# EasyEDA schematic SCH_MR2-reactive-led-system-new-audio-system_2026-09-23.json
TITLE: Reactive LED System; REV: 1.0; Date: 2026-07-09; Sheet: 1/1; Drawn By: Kilian Mckinstry; Company: N/A
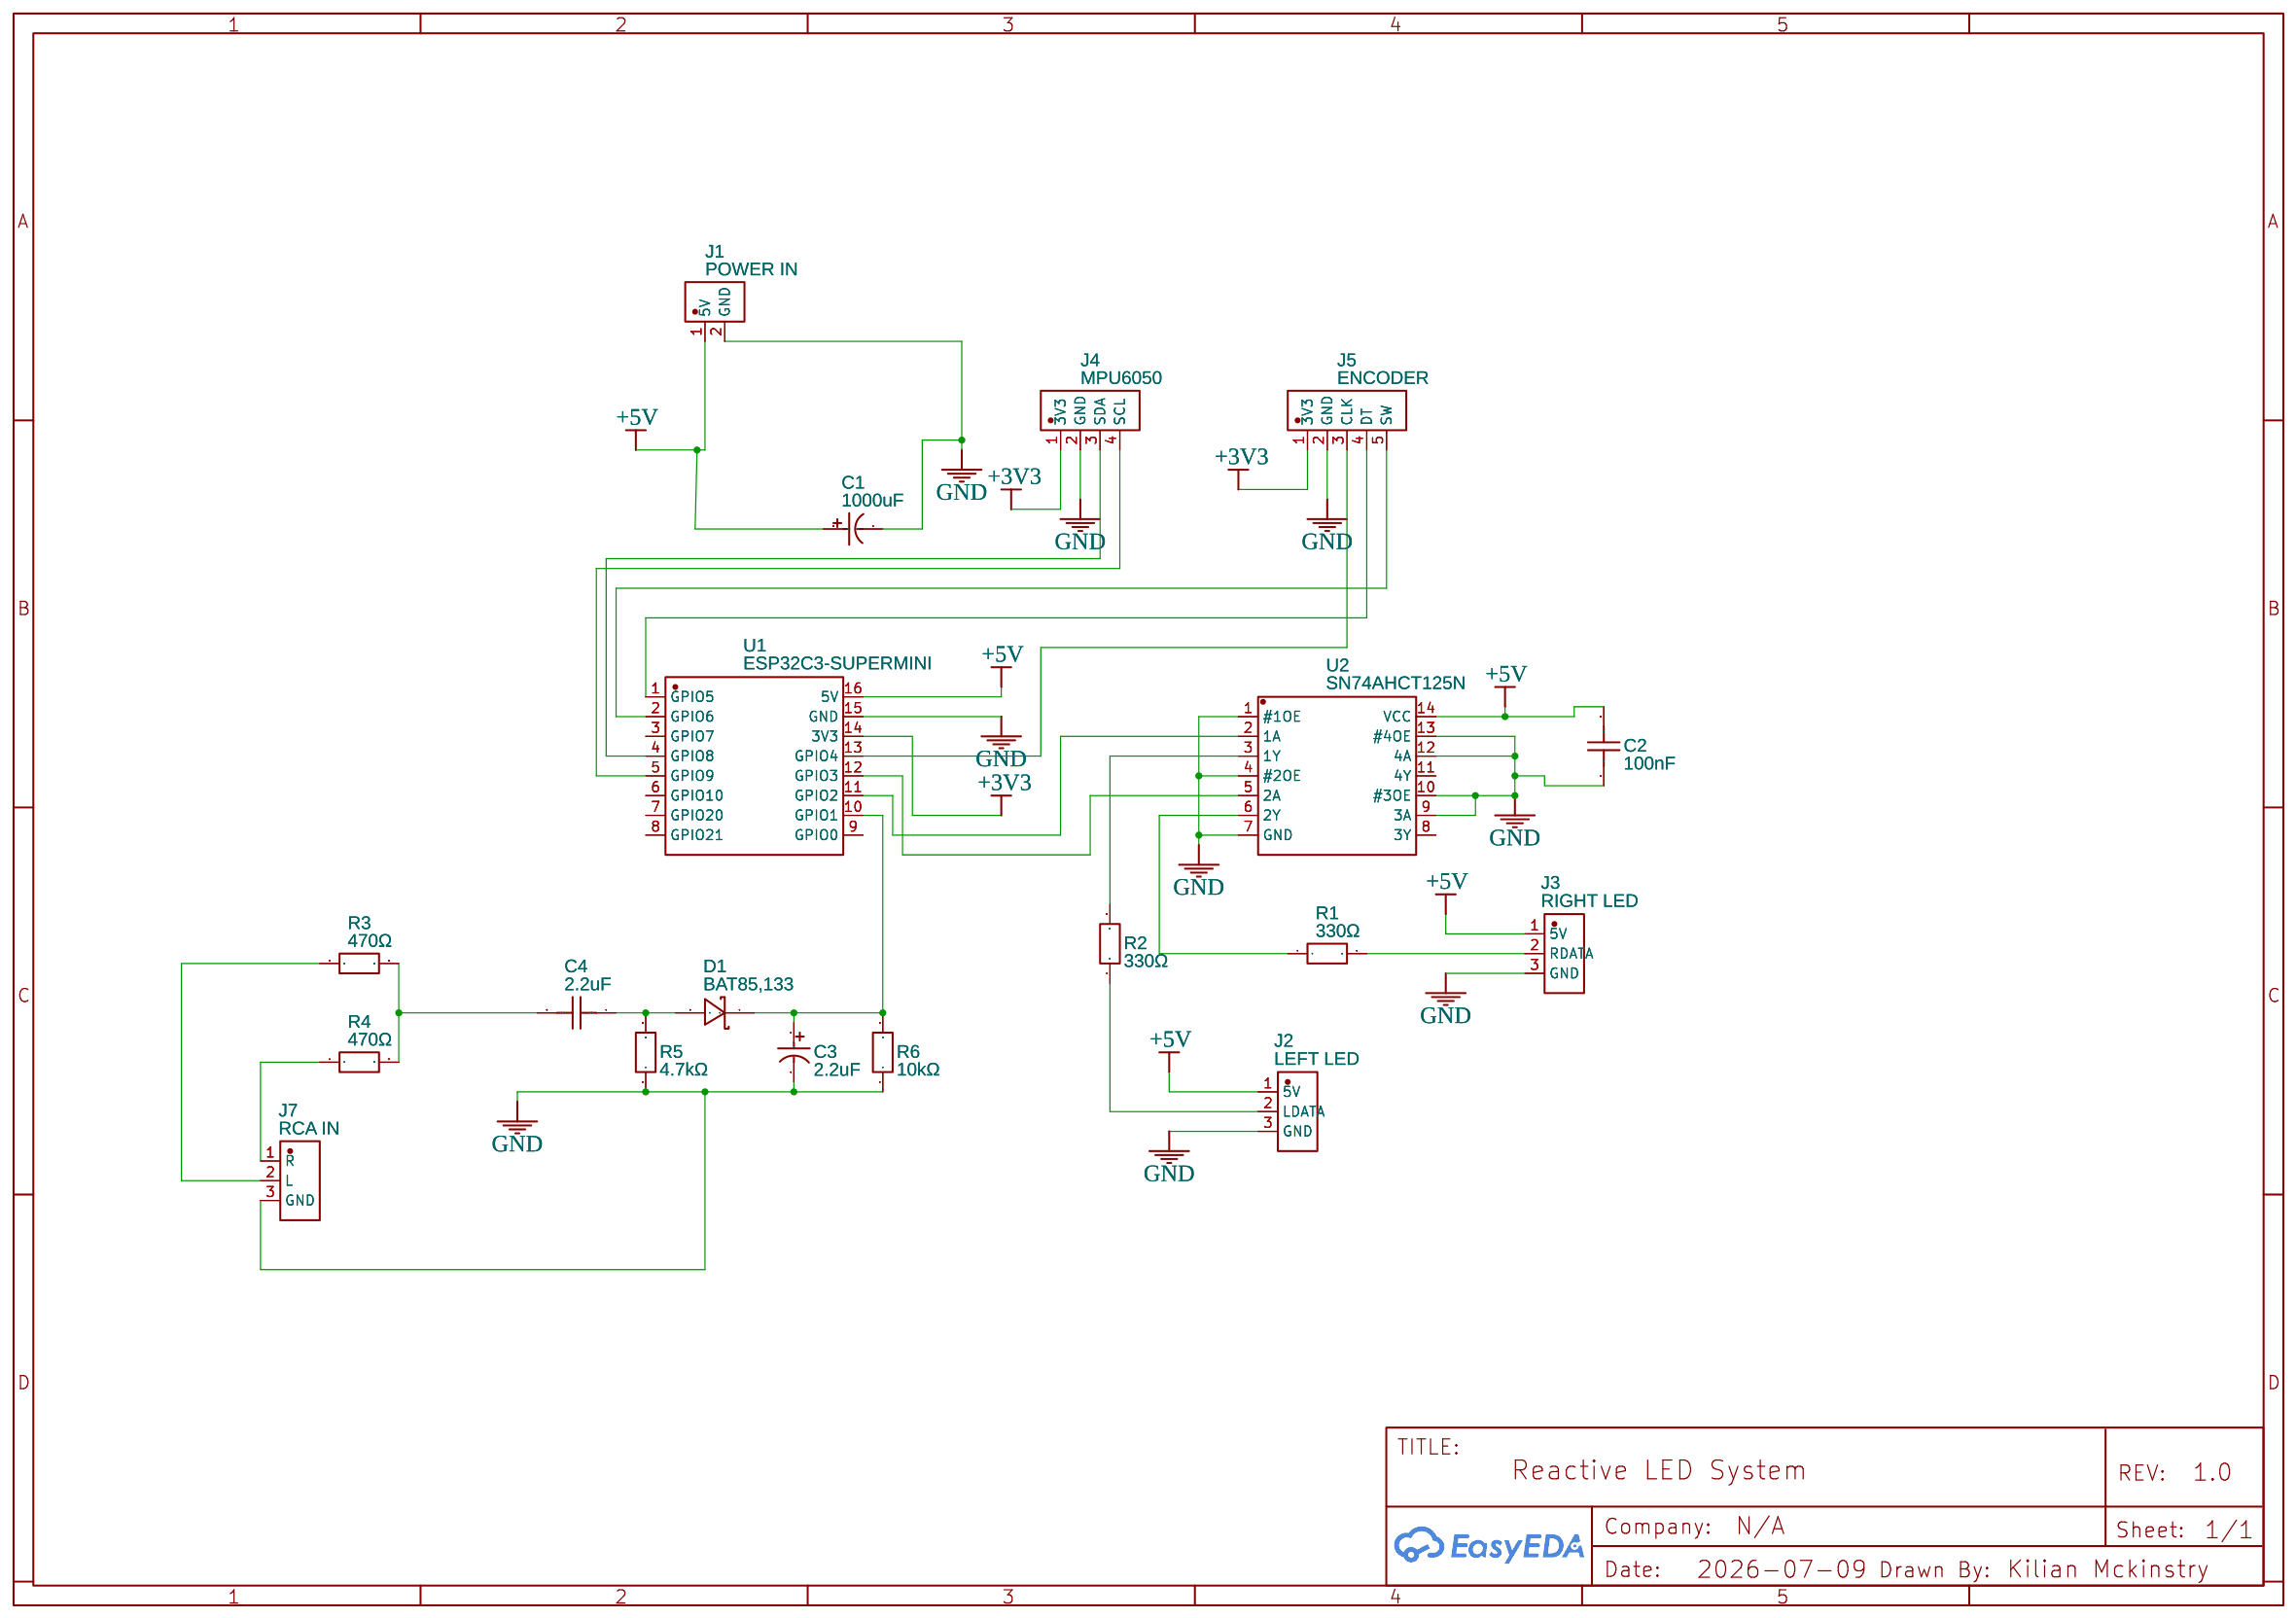
[diagram p0: schematic sheet]

## Parts
C1  1000uF  [CAP-TH_BD4.0-P1.50-D0.8-FD]
C2  100nF  [CAP-TH_L10.0-W4.0-P5.00-D0.6]
C3  2.2uF  [CAP-TH_BD4.0-P1.50-D0.8-FD]
C4  2.2uF  [CAP-TH_L10.0-W4.0-P5.00-D0.6]
D1  BAT85,133  [DO-34_BD1.6-L3.0-P7.00-D0.6-RD]
J1  POWER IN  [CONN-TH_XH2.54-2P]
J2  LEFT LED  [CONN-TH_XH2.54-3P]
J3  RIGHT LED  [CONN-TH_XH2.54-3P]
J4  MPU6050  [CONN-TH_XH2.54-4P]
J5  ENCODER  [CONN-TH_XH2.54-5P]
J7  RCA IN  [CONN-TH_XH2.54-3P]
R1  330Ω  [RES-TH_BD2.3-L3.7-P7.70-D0.9]
R2  330Ω  [RES-TH_BD2.3-L3.7-P7.70-D0.9]
R3  470Ω  [RES-TH_BD2.3-L3.7-P7.70-D0.9]
R4  470Ω  [RES-TH_BD2.3-L3.7-P7.70-D0.9]
R5  4.7kΩ  [RES-TH_BD2.3-L3.7-P7.70-D0.9]
R6  10kΩ  [RES-TH_BD2.3-L3.7-P7.70-D0.9]
U1  ESP32C3-SUPERMINI  [COMM-SMD_16P-L22.5-W18.0-P2.54-TL]
U2  SN74AHCT125N  [PDIP-14_L19.3-W6.4-P2.54-LS7.6-BL]

## Library data of the parts
C1 C3 = electrolytic capacitor10UF50V: Supplier: LCSC; Manufacturer: Chengx(承兴); Manufacturer Part: KS106M050C07RR0VH2FP0; Supplier Part: C32856; JLCPCB Part Class: Extended Part
C2 C4 = DCM472K39Y5PL6FJ5A0: Contributor: lcsc; Supplier: LCSC; Supplier Part: C2896105; Manufacturer: SHM(南方宏明); JLCPCB Part Class: Extended Part
D1 = BAT85,133: Contributor: LCSC; Supplier: LCSC; Manufacturer: Nexperia(安世); Supplier Part: C134301; JLCPCB Part Class: Extended Part
J1 = XH2.54-2PIN-直针: Contributor: LCSC; Supplier: LCSC; Supplier Part: C9900011425; Manufacturer: null; JLCPCB Part Class: Extended Part
J2 J3 J7 = XH_2.54_3P: Contributor: LCSC; Supplier: LCSC; Supplier Part: C9900004241; Manufacturer: null; JLCPCB Part Class: Extended Part
J4 = WAFER-XH254Z-4AL: Supplier: LCSC; Supplier Part: C22751797; Manufacturer: HANBO(汉博); Contributor: lcsc; JLCPCB Part Class: Extended Part
J5 = XH_2.54_5P: Contributor: LCSC; Supplier: LCSC; Supplier Part: C9900004239; Manufacturer: null; JLCPCB Part Class: Extended Part
R1-R6 = CR1/8W-56K±5%-ST52: Contributor: lcsc; Supplier: LCSC; Supplier Part: C2897076; Manufacturer: VO(翔胜); JLCPCB Part Class: Extended Part
U1 = ESP32C3-SUPERMINI: Supplier: LCSC; Supplier Part: C9900147397; Manufacturer: null; Manufacturer Part: ESP32C3-SuperMini; JLCPCB Part Class: Extended Part; Contributor: lcsc
U2 = SN74AHCT125N: Contributor: LCSC; Supplier: LCSC; Supplier Part: C354152; Manufacturer: TI(德州仪器); JLCPCB Part Class: Extended Part

## Nets
+3V3: J4.1(3V3) J5.1(3V3) U1.14(3V3)
+5V: C1.1(+) C2.2 J1.1(5V) J2.1(5V) J3.1(5V) U1.16(5V) U2.14(VCC)
GND: C1.2(-) C2.1 C3.2(-) J1.2(GND) J2.3(GND) J3.3(GND) J4.2(GND) J5.2(GND) J7.3(GND) R5.1 R6.1 U1.15(GND) U2.1(#1OE) U2.4(#2OE) U2.7(GND) U2.9(3A) U2.10(#3OE) U2.12(4A) U2.13(#4OE)
Net-(C3-1): C3.1(+) D1.1(K) R6.2 U1.10(GPIO1)
Net-(C4-1): C4.1 D1.2(A) R5.2
Net-(C4-2): C4.2 R3.2 R4.2
Net-(J2-2): J2.2(LDATA) R2.1
Net-(J3-2): J3.2(RDATA) R1.2
Net-(J4-3): J4.3(SDA) U1.4(GPIO8)
Net-(J4-4): J4.4(SCL) U1.5(GPIO9)
Net-(J5-3): J5.3(CLK) U1.13(GPIO4)
Net-(J5-4): J5.4(DT) U1.1(GPIO5)
Net-(J5-5): J5.5(SW) U1.2(GPIO6)
Net-(J7-1): J7.1(R) R4.1
Net-(J7-2): J7.2(L) R3.1
Net-(R1-1): R1.1 U2.6(2Y)
Net-(R2-2): R2.2 U2.3(1Y)
Net-(U1-11): U1.11(GPIO2) U2.2(1A)
Net-(U1-12): U1.12(GPIO3) U2.5(2A)

Not connected (* = marked no-connect by the designer): U1 3(GPIO7) 6(GPIO10) 7(GPIO20) 8(GPIO21) 9(GPIO0); U2 8(3Y) 11(4Y)
